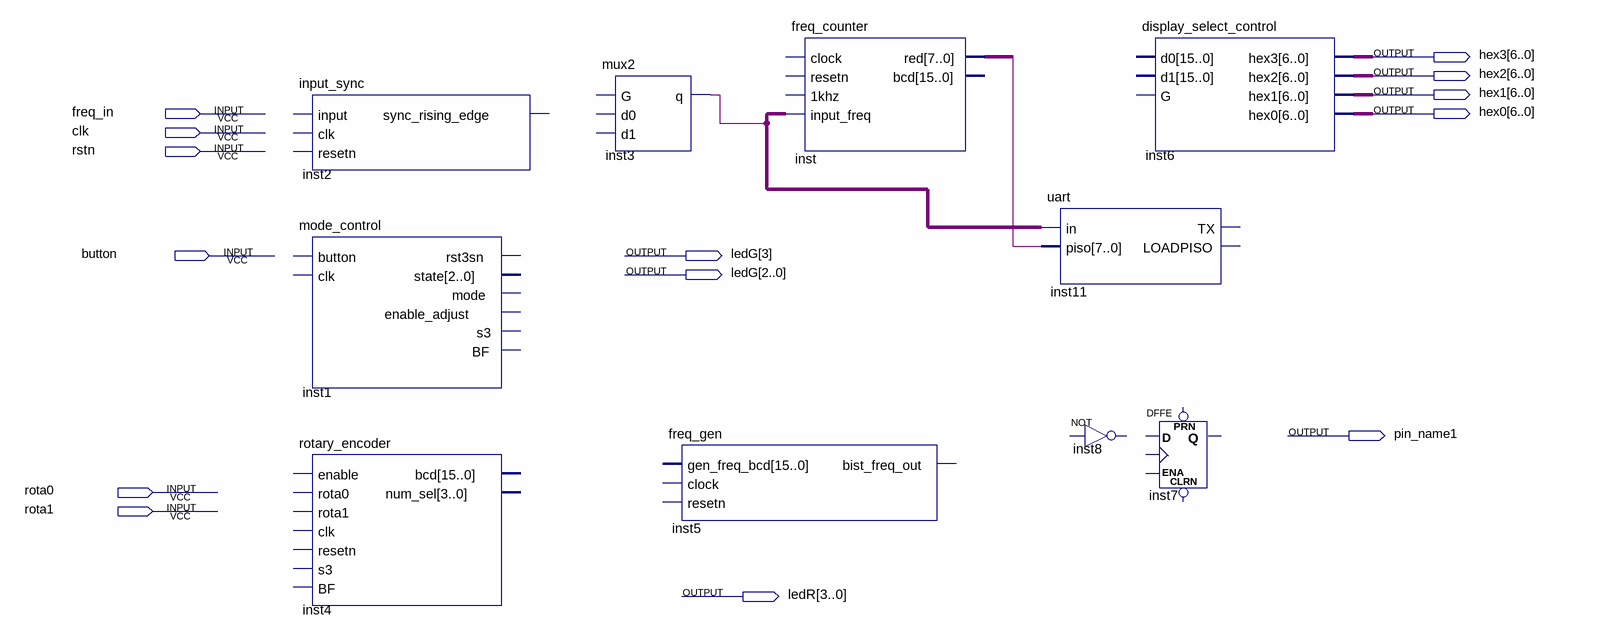
[diagram p0: schematic sheet]
// Quartus schematic harkka2018.bdf as structural Verilog: 10 symbols, 14 pins
module harkka2018 (
  input  freq_in,
  input  clk,
  input  rstn,
  input  button,
  input  rota0,
  input  rota1,
  output [6:0] hex3,
  output [6:0] hex2,
  output [6:0] hex1,
  output [6:0] hex0,
  output [3:0] ledG,
  output pin_name1,
  output [3:0] ledR
);

  wire inst3_q, undriven;
  wire [7:0] inst_red;

  input_sync inst2 ();  // open: input, clk, resetn, sync_rising_edge
  mode_control inst1 ();  // open: button, clk, rst3sn, state, mode, enable_adjust, s3, BF
  rotary_encoder inst4 ();  // open: enable, rota0, rota1, clk, resetn, s3, BF, bcd, num_sel
  mux2 inst3 (.q(inst3_q));  // open: G, d0, d1
  freq_gen inst5 ();  // open: gen_freq_bcd, clock, resetn, bist_freq_out
  freq_counter inst (.input_freq(inst3_q), .red(inst_red));  // open: clock, resetn, 1khz, bcd
  uart inst11 (.in(inst3_q), .piso({8{undriven}}));  // open: TX, LOADPISO
  // NOT inst8 is placed but not wired
  display_select_control inst6 (.hex3(hex3), .hex2(hex2), .hex1(hex1), .hex0(hex0));  // open: d0, d1, G
  DFFE inst7 ();  // open: PRN, CLRN, D, CLK, ENA, Q
endmodule
